# Altium schematic sheet Sheet2.SchDoc
size A4
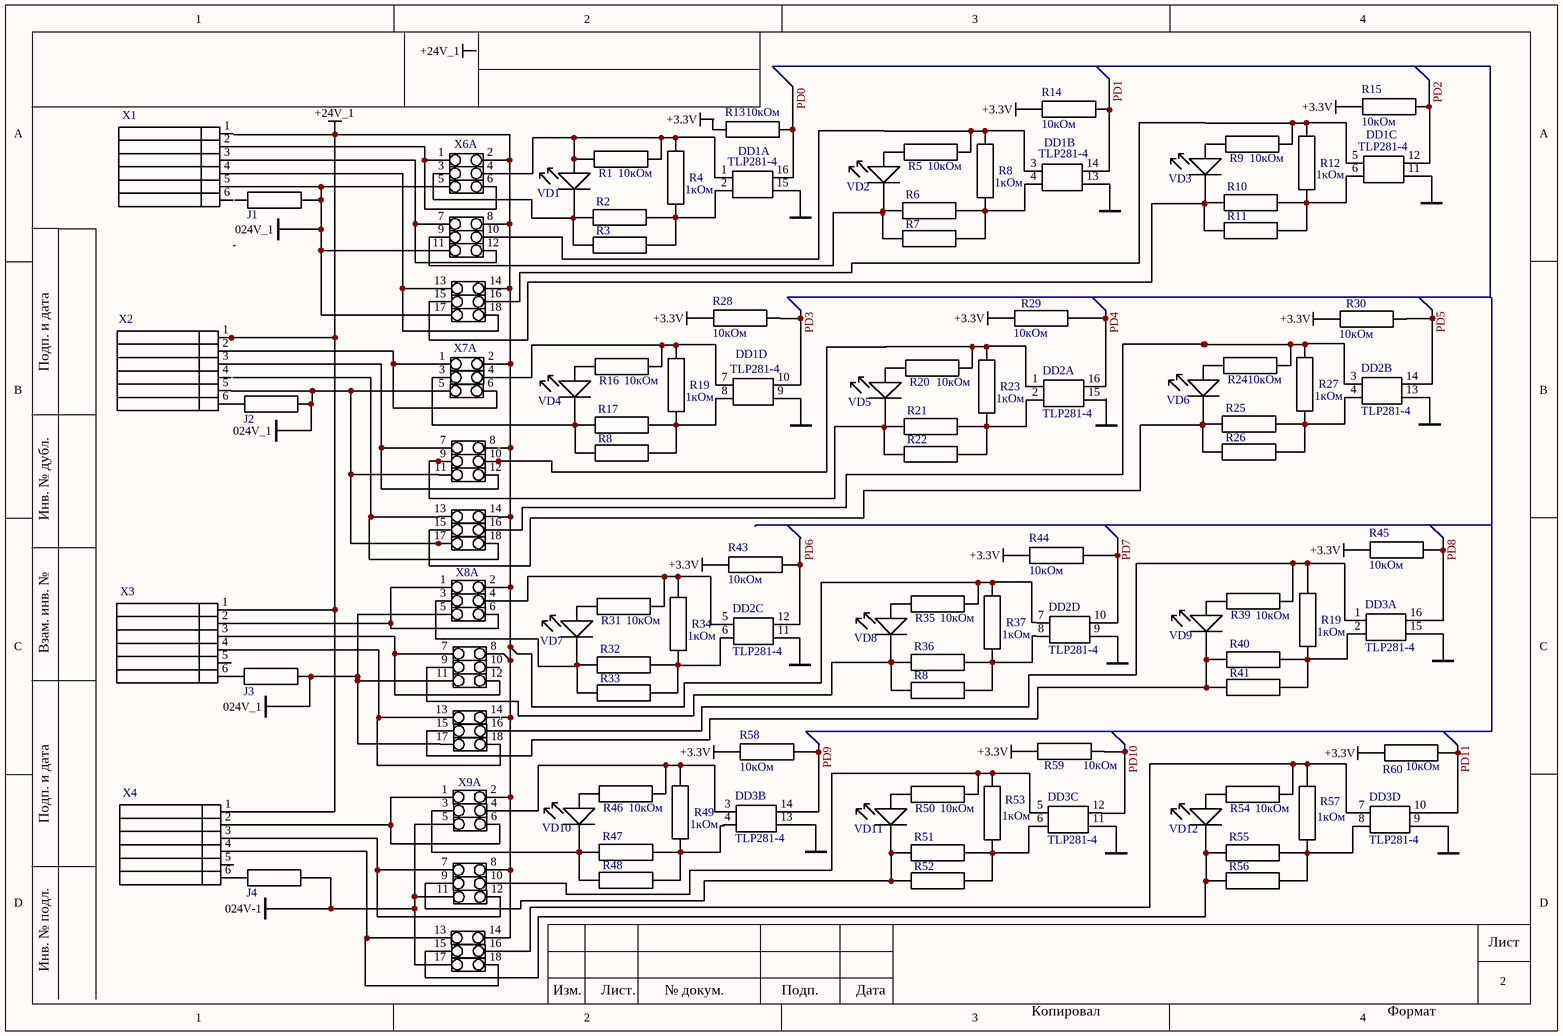
[diagram p0: Sheet2.SchDoc]

## Parts
(Parts that share a designator on the sheet are numbered #1, #2 ... from top to bottom, then left to right.)
*#1  jamp20  (value not drawn)  (part D of 10)
*#2  jamp20  (value not drawn)  (part E of 10)
*#3  jamp20  (value not drawn)  (part F of 10)
*#4  jamp20  (value not drawn)  (part G of 10)
*#5  jamp20  (value not drawn)  (part H of 10)
*#6  jamp20  (value not drawn)  (part I of 10)
*#7  jamp20  (value not drawn)  (part B of 10)
*#8  jamp20  (value not drawn)  (part C of 10)
*#9  jamp20  (value not drawn)  (part D of 10)
*#10  jamp20  (value not drawn)  (part E of 10)
*#11  jamp20  (value not drawn)  (part F of 10)
*#12  jamp20  (value not drawn)  (part G of 10)
*#13  jamp20  (value not drawn)  (part H of 10)
*#14  jamp20  (value not drawn)  (part I of 10)
*#15  jamp20  (value not drawn)  (part B of 10)
*#16  jamp20  (value not drawn)  (part C of 10)
*#17  jamp20  (value not drawn)  (part D of 10)
*#18  jamp20  (value not drawn)  (part E of 10)
*#19  jamp20  (value not drawn)  (part F of 10)
*#20  jamp20  (value not drawn)  (part G of 10)
*#21  jamp20  (value not drawn)  (part H of 10)
*#22  jamp20  (value not drawn)  (part I of 10)
DD1  TLP281-4  (parts A,B,C,D of 4)
DD2  TLP281-4  (parts A,B,C,D of 4)
DD3  TLP281-4  (parts A,B,C,D of 4)
J1  R0805  (value not drawn)
J2  R0805  (value not drawn)
J3  R0805  (value not drawn)
J4  R0805  (value not drawn)
R1  R0805  (value not drawn)
R2  R0805  (value not drawn)
R3  R0805  (value not drawn)
R4  R0805  (value not drawn)
R5  R0805  (value not drawn)
R6  R0805  (value not drawn)
R7  R0805  (value not drawn)
R8#1  R0805  (value not drawn)
R8#2  R0805  (value not drawn)
R8#3  R0805  (value not drawn)
R9  R0805  (value not drawn)
R10  R0805  (value not drawn)
R11  R0805  (value not drawn)
R12  R0805  (value not drawn)
R13  R0805  (value not drawn)
R14  R0805  (value not drawn)
R15  R0805  (value not drawn)
R16  R0805  (value not drawn)
R17  R0805  (value not drawn)
R19#1  R0805  (value not drawn)
R19#2  R0805  (value not drawn)
R20  R0805  (value not drawn)
R21  R0805  (value not drawn)
R22  R0805  (value not drawn)
R23  R0805  (value not drawn)
R24  R0805  (value not drawn)
R25  R0805  (value not drawn)
R26  R0805  (value not drawn)
R27  R0805  (value not drawn)
R28  R0805  (value not drawn)
R29  R0805  (value not drawn)
R30  R0805  (value not drawn)
R31  R0805  (value not drawn)
R32  R0805  (value not drawn)
R33  R0805  (value not drawn)
R34  R0805  (value not drawn)
R35  R0805  (value not drawn)
R36  R0805  (value not drawn)
R37  R0805  (value not drawn)
R39  R0805  (value not drawn)
R40  R0805  (value not drawn)
R41  R0805  (value not drawn)
R43  R0805  (value not drawn)
R44  R0805  (value not drawn)
R45  R0805  (value not drawn)
R46  R0805  (value not drawn)
R47  R0805  (value not drawn)
R48  R0805  (value not drawn)
R49  R0805  (value not drawn)
R50  R0805  (value not drawn)
R51  R0805  (value not drawn)
R52  R0805  (value not drawn)
R53  R0805  (value not drawn)
R54  R0805  (value not drawn)
R55  R0805  (value not drawn)
R56  R0805  (value not drawn)
R57  R0805  (value not drawn)
R58  R0805  (value not drawn)
R59  R0805  (value not drawn)
R60  R0805  (value not drawn)
VD1  LED  (value not drawn)
VD2  LED  (value not drawn)
VD3  LED  (value not drawn)
VD4  LED  (value not drawn)
VD5  LED  (value not drawn)
VD6  LED  (value not drawn)
VD7  LED  (value not drawn)
VD8  LED  (value not drawn)
VD9  LED  (value not drawn)
VD10  LED  (value not drawn)
VD11  LED  (value not drawn)
VD12  LED  (value not drawn)
X1  PLS-6  (value not drawn)
X2  PLS-6  (value not drawn)
X3  PLS-6  (value not drawn)
X4  PLS-6  (value not drawn)
X6  jamp20  (value not drawn)  (parts A,B,C,D,E,F,G,H,I of 10)
X7  jamp20  (value not drawn)  (parts A,B,C of 10)
X8  jamp20  (value not drawn)  (part A of 10)
X9  jamp20  (value not drawn)  (part A of 10)

## Nets
024V-1: *#16.5 *#19.11 *#22.17 J4.2
024V_1: *#3.11 *#6.17 *#8.5 *#11.11 *#14.17 J1.2 J2.2 J3.2 X1.5 X2.5 X6.5 X6.11 X6.17 X7.5
+3.3V: R13.1 R14.1 R15.1 R28.1 R29.1 R30.1 R43.1 R44.1 R45.1 R58.1 R59.1 R60.1
+24V_1: *#4.14 *#9.8 *#17.8 *#20.14 R35.2 R37.2 X2.1 X3.1 X4.1 X6.2 X6.8 X6.14 X7.2 X8.2 X9.2
GND: DD1.9 DD1.11 DD1.13 DD1.15 DD2.9 DD2.11 DD2.13 DD2.15 DD3.9 DD3.11 DD3.13 DD3.15
PD0: DD1.16 R13.2
PD1: DD1.14 R14.2
PD2: DD1.12 R15.2
PD3: DD1.10 R28.2
PD4: DD2.16 R29.2
PD5: DD2.14 R30.2
PD6: DD2.12 R43.2
PD7: DD2.10 R44.2
PD8: DD3.16 R45.2
PD9: DD3.14 R58.2
PD10: DD3.12 R59.2
PD11: DD3.10 R60.2
Net*#1_7: *#1.7 *#3.12 X2.3
Net*#2_10: *#2.10 DD2.1 R20.2 R23.2
Net*#4_13: *#4.13 *#6.18
Net*#5_15: *#5.15 R25.1 R26.1 VD6.1(A)
Net*#5_16: *#5.16 DD2.3 R24.2 R27.2
Net*#7_3: *#7.3 R32.1 R33.1 VD7.1(A)
Net*#7_4: *#7.4 DD2.5 R31.2 R34.2
Net*#8_6: *#8.6 X3.2 X8.1
Net*#9_7: *#9.7 *#11.12 X3.3
Net*#10_9: *#10.9 R8#3.1 R36.1 VD8.1(A)
Net*#12_13: *#12.13 *#14.18 X3.4
Net*#13_15: *#13.15 R40.1 R41.1 VD9.1(A)
Net*#13_16: *#13.16 DD3.1 R19#2.2 R39.2
Net*#15_3: *#15.3 R47.1 R48.1 VD10.1(A)
Net*#15_4: *#15.4 DD3.3 R46.2 R49.2
Net*#16_6: *#16.6 X4.2 X9.1
Net*#17_7: *#17.7 *#19.12 X4.3
Net*#18_9: *#18.9 R51.1 R52.1 VD11.1(A)
Net*#18_10: *#18.10 DD3.5 R50.2 R53.2
Net*#20_13: *#20.13 *#22.18 X4.4
Net*#21_15: *#21.15 R55.1 R56.1 VD12.1(A)
Net*#21_16: *#21.16 DD3.7 R54.2 R57.2
NetDD1_1: DD1.1 R1.1 R1.2 R4.2 VD1.2(K) X6.4
NetDD1_2: DD1.2 R2.2 R3.2 R4.1
NetDD1_3: DD1.3 R5.2 R8#1.2 X6.10
NetDD1_4: DD1.4 R6.2 R7.2 R8#1.1
NetDD1_5: DD1.5 R9.2 R12.2 X6.16
NetDD1_6: DD1.6 R10.2 R11.2 R12.1
NetDD1_7: DD1.7 R16.2 R19#1.2 X7.4
NetDD1_8: DD1.8 R8#2.2 R17.2 R19#1.1
NetDD2_2: DD2.2 R21.2 R22.2 R23.1
NetDD2_4: DD2.4 R25.2 R26.2 R27.1
NetDD2_6: DD2.6 R32.2 R33.2 R34.1
NetDD3_6: DD3.6 R51.2 R52.2 R53.1
NetDD3_8: DD3.8 R55.2 R56.2 R57.1
NetJ2_1: J2.1 X2.6
NetJ3_1: J3.1 X3.6
NetJ4_1: J4.1 X4.6
NetR2_1: R2.1 R3.1 VD1.1(A) X6.3
NetR5_1: R5.1 VD2.2(K)
NetR6_1: R6.1 R7.1 VD2.1(A) X6.9
NetR8#2_1: R8#2.1 R17.1 VD4.1(A) X7.3
NetR8#3_2: R8#3.2 R36.2 R37.1
NetR9_1: R9.1 VD3.2(K)
NetR10_1: R10.1 R11.1 VD3.1(A) X6.15
NetR16_1: R16.1 VD4.2(K)
NetR19#2_1: R19#2.1 R40.2 R41.2
NetR20_1: R20.1 VD5.2(K)
NetR21_1: R21.1 R22.1 VD5.1(A)
NetR24_1: R24.1 VD6.2(K)
NetR31_1: R31.1 VD7.2(K)
NetR35_1: R35.1 VD8.2(K)
NetR39_1: R39.1 VD9.2(K)
NetR46_1: R46.1 VD10.2(K)
NetR47_2: R47.2 R48.2 R49.1
NetR50_1: R50.1 VD11.2(K)
NetR54_1: R54.1 VD12.2(K)
NetX1_2: X1.2 X6.1 X6.6
NetX1_3: X1.3 X6.7 X6.12
NetX1_4: X1.4 X6.13 X6.18
NetX2_2: X2.2 X7.1 X7.6

Not connected (* = marked no-connect by the designer): *#1 8; *#2 9; *#10 10; *#12 14; DD2 7 8; DD3 2 4; J1 1; X1 1 6; X2 4; X3 5; X4 5

## Notes on the sheet
- 2
- Labels drawn without touching a wire or pin: +24V_1
- Подп. и дата
- Инв. № дубл.
- Взам. инв. №
- Инв. № подл.
- Лист
- Изм.
- Лист.
- № докум.
- Подп.
- Дата
- Копировал
- Формат
- (in symbol R0805) 10кОм; 1кОм